# Altium schematic sheet RF.SchDoc: STM32WB55RG RF part
size A4; Author: PhA; SheetNumber: 3; SheetTotal: 6
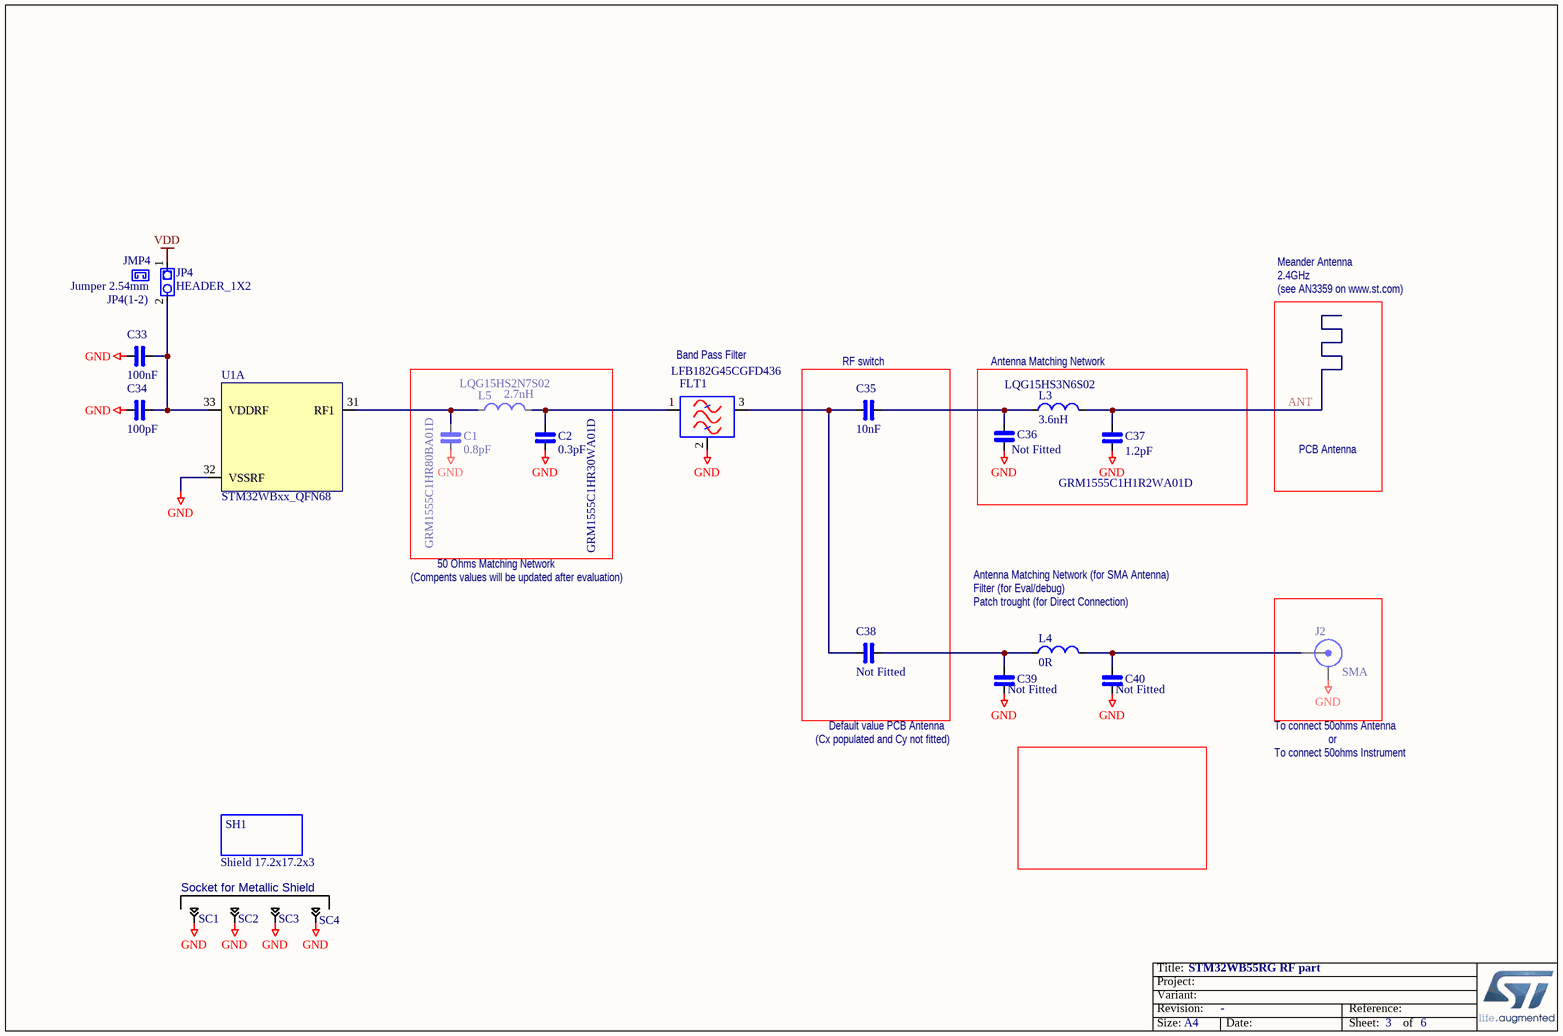
[diagram p0: RF.SchDoc]

## Parts
C1  0.8pF  REF: GRM1555C1HR80BA01D  [0402_CAP_NPOL]
C2  0.3pF  REF: GRM1555C1HR30WA01D  [0402_CAP_NPOL]
C33  100nF  [0402_CAP_NPOL]
C34  100pF  [0402_CAP_NPOL]
C35  10nF  [0402_CAP_NPOL]
C36  Fitted: Not Fitted  [0402_CAP_NPOL]
C37  1.2pF  Ref: GRM1555C1H1R2WA01D  [0402_CAP_NPOL]
C38  Fitted: Not Fitted  [0402_CAP_NPOL]
C39  Fitted: Not Fitted  [0402_CAP_NPOL]
C40  Fitted: Not Fitted  [0402_CAP_NPOL]
FLT1  LFB182G45CGFD436  [LFB182G45CGFD436]
J2  SMA  [SMA_T_9.52_NF]
JMP4  Jumper 2.54mm  default: JP4(1-2)  [Jumper 2.54mm BLACK]
JP4  HEADER_1X2  [Header M 1x2x2.54 TH V]
L3  3.6nH  Ref: LQG15HS3N6S02  [0402_COIL]
L4  0R  [0402_COIL]
L5  2.7nH  Ref: LQG15HS2N7S02  [0402_COIL]
SC1  Shield Clip_A 3.9x1.1x1.28  [Shield Clip_A 3.9x1.1x1.28]  (value not drawn)
SC2  Shield Clip_A 3.9x1.1x1.28  [Shield Clip_A 3.9x1.1x1.28]  (value not drawn)
SC3  Shield Clip_A 3.9x1.1x1.28  [Shield Clip_A 3.9x1.1x1.28]  (value not drawn)
SC4  Shield Clip_A 3.9x1.1x1.28  [Shield Clip_A 3.9x1.1x1.28]  (value not drawn)
SH1  Shield 17.2x17.2x3  [Shield 17.2x17.2x3]
U1  STM32WBxx_QFN68  [VFQFPN68_8x8x0.1_p0.4]  (part A of 5)

## Blocks framed on the sheet
RF switch: C35 C38
Antenna Matching Network: C36 C37 L3

## Nets
GND: C1.1 C2.1 C33.1 C34.1 C36.2 C37.1 C39.1 C40.1 FLT1.2(GND) J2.2(Y) SC1.1 SC2.1 SC3.1 SC4.1 U1.32(VSSRF)
VDD: JP4.1
ANT: C37.2 L3.2
NetC1_2: C1.2 L5.1 U1.31(RF1)
NetC2_2: C2.2 FLT1.1(I/O) L5.2
NetC33_2: C33.2 C34.2 JP4.2 U1.33(VDDRF)
NetC35_1: C35.1 C38.1 FLT1.3(I/O)
NetC35_2: C35.2 C36.1 L3.1
NetC38_2: C38.2 C39.2 L4.1
NetC40_2: C40.2 J2.1(X) L4.2

## Notes on the sheet
- Meander Antenna
- 2.4GHz
- (see AN3359 on www.st.com)
- (near FLT1) Band Pass Filter
- PCB Antenna
- (Compents values will be updated after evaluation)
- 50 Ohms Matching Network
- Antenna Matching Network (for SMA Antenna)
- Filter (for Eval/debug)
- Patch trought (for Direct Connection)
- (near C39) (Cx populated and Cy not fitted)
- Default value PCB Antenna
- To connect 50ohms Antenna
- To connect 50ohms Instrument
- or
- Socket for Metallic Shield
- Title:
- Project:
- Size:
- Revision:
- Variant:
- A4
- -
- Date:
- Reference:
- Sheet:
- of

## Library data of the parts
C1 C2 C33 C34 C36-C40 = CAP_NPOL: Capacitor_not polarized
  C37: Fitted: Fitted
C35 = CAP_NPOL: Capacitor_not polarized; Ref: Murata GRM155R71H103KA88
FLT1 = LFB182G45CGFD436: Band Pass Filter Murata LFB182G45CGFD436
JP4 = HEADER_1X2_L
L3-L5 = INDUCTOR_SMD_STDL
SC1-SC4 = Shield Clip_A 3.9x1.1x1.28: Harwin S0951-46R
SH1 = Shield